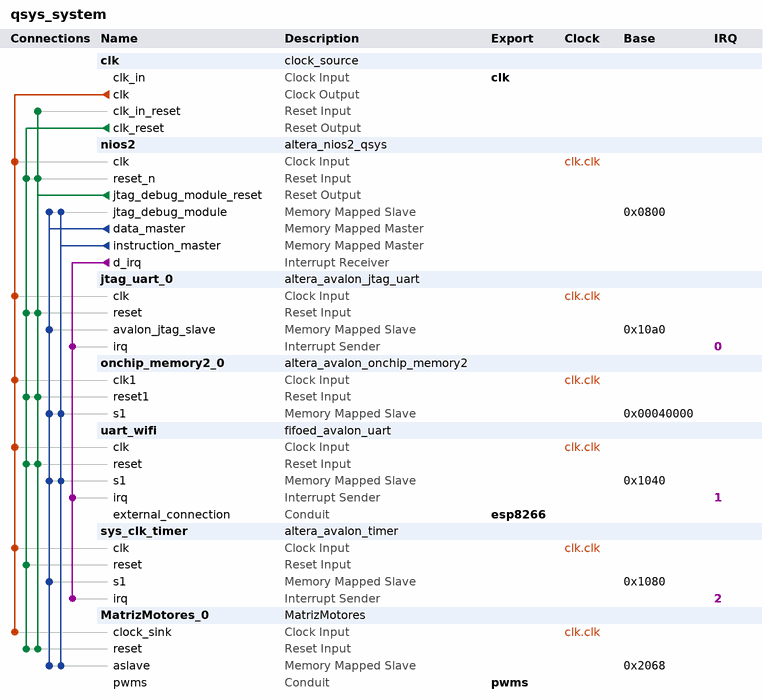
[diagram p0: system contents]
# Platform Designer (Qsys) system qsys_system, Cyclone IV GX EP4CGX150DF31C7
# Parameters at their usual value, and those the tool derives, are not listed.
package require -exact qsys 13.0.1.99.2
create_system qsys_system
set_project_property DEVICE_FAMILY {Cyclone IV GX}
set_project_property DEVICE EP4CGX150DF31C7

add_instance clk clock_source 13.0
set_instance_parameter_value clk clockFrequency 50000000

add_instance nios2 altera_nios2_qsys 13.0
set_instance_parameter_value nios2 resetSlave onchip_memory2_0.s1
set_instance_parameter_value nios2 mmu_TLBMissExcSlave None
set_instance_parameter_value nios2 exceptionSlave onchip_memory2_0.s1
set_instance_parameter_value nios2 breakSlave nios2.jtag_debug_module
set_instance_parameter_value nios2 impl Tiny
set_instance_parameter_value nios2 icache_size 4096

add_instance jtag_uart_0 altera_avalon_jtag_uart 13.0.1.99.2
set_instance_parameter_value jtag_uart_0 simInteractiveOptions NO_INTERACTIVE_WINDOWS

add_instance onchip_memory2_0 altera_avalon_onchip_memory2 13.0.1.99.2
set_instance_parameter_value onchip_memory2_0 dataWidth 32
set_instance_parameter_value onchip_memory2_0 dualPort false
set_instance_parameter_value onchip_memory2_0 initMemContent true
set_instance_parameter_value onchip_memory2_0 initializationFileName onchip_mem.hex
set_instance_parameter_value onchip_memory2_0 memorySize 100000

add_instance uart_wifi fifoed_avalon_uart 13.2
set_instance_parameter_value uart_wifi baud 115200
set_instance_parameter_value uart_wifi dataBits 8
set_instance_parameter_value uart_wifi fixedBaud true
set_instance_parameter_value uart_wifi parity NONE
set_instance_parameter_value uart_wifi simInteractiveInputEnable false
set_instance_parameter_value uart_wifi simInteractiveOutputEnable false
set_instance_parameter_value uart_wifi simTrueBaud false
set_instance_parameter_value uart_wifi stopBits 1
set_instance_parameter_value uart_wifi syncRegDepth 2
set_instance_parameter_value uart_wifi useCtsRts false
set_instance_parameter_value uart_wifi useEopRegister false
set_instance_parameter_value uart_wifi useRelativePathForSimFile false
set_instance_parameter_value uart_wifi use_status_bit_clear false
set_instance_parameter_value uart_wifi use_tx_fifo true
set_instance_parameter_value uart_wifi fifo_size_tx 1024
set_instance_parameter_value uart_wifi tx_fifo_LE false
set_instance_parameter_value uart_wifi tx_IRQ_Threshold 1
set_instance_parameter_value uart_wifi use_rx_fifo true
set_instance_parameter_value uart_wifi fifo_size_rx 1024
set_instance_parameter_value uart_wifi rx_fifo_LE false
set_instance_parameter_value uart_wifi rx_IRQ_Threshold 1
set_instance_parameter_value uart_wifi fifo_export_used false
set_instance_parameter_value uart_wifi hw_cts false
set_instance_parameter_value uart_wifi trans_pin false
set_instance_parameter_value uart_wifi use_timout false
set_instance_parameter_value uart_wifi timeout_value 4
set_instance_parameter_value uart_wifi use_gap_detection false
set_instance_parameter_value uart_wifi gap_value 4
set_instance_parameter_value uart_wifi use_timestamp false
set_instance_parameter_value uart_wifi use_ext_timestamp false
set_instance_parameter_value uart_wifi timestamp_width 8
set_instance_parameter_value uart_wifi export_handshake false
set_instance_parameter_value uart_wifi add_error_bits false
set_instance_parameter_value uart_wifi driver_pass_error_bits false

add_instance sys_clk_timer altera_avalon_timer 13.0.1.99.2
set_instance_parameter_value sys_clk_timer period 1
set_instance_parameter_value sys_clk_timer periodUnits MSEC

add_instance MatrizMotores_0 MatrizMotores 1.0
set_instance_parameter_value MatrizMotores_0 rows 4
set_instance_parameter_value MatrizMotores_0 cols 8
set_instance_parameter_value MatrizMotores_0 time_constant 1000000
set_instance_parameter_value MatrizMotores_0 divisor 2000

# connections
add_connection clk.clk jtag_uart_0.clk clock
add_connection clk.clk MatrizMotores_0.clock_sink clock
add_connection clk.clk nios2.clk clock
add_connection clk.clk onchip_memory2_0.clk1 clock
add_connection clk.clk sys_clk_timer.clk clock
add_connection clk.clk uart_wifi.clk clock
add_connection clk.clk_reset jtag_uart_0.reset reset
add_connection clk.clk_reset MatrizMotores_0.reset reset
add_connection clk.clk_reset nios2.reset_n reset
add_connection clk.clk_reset onchip_memory2_0.reset1 reset
add_connection clk.clk_reset sys_clk_timer.reset reset
add_connection clk.clk_reset uart_wifi.reset reset
add_connection nios2.jtag_debug_module_reset clk.clk_in_reset reset
add_connection nios2.jtag_debug_module_reset jtag_uart_0.reset reset
add_connection nios2.jtag_debug_module_reset MatrizMotores_0.reset reset
add_connection nios2.jtag_debug_module_reset nios2.reset_n reset
add_connection nios2.jtag_debug_module_reset onchip_memory2_0.reset1 reset
add_connection nios2.jtag_debug_module_reset uart_wifi.reset reset
add_connection nios2.data_master jtag_uart_0.avalon_jtag_slave avalon
set_connection_parameter_value nios2.data_master/jtag_uart_0.avalon_jtag_slave baseAddress 0x10a0
add_connection nios2.data_master MatrizMotores_0.aslave avalon
set_connection_parameter_value nios2.data_master/MatrizMotores_0.aslave baseAddress 0x2068
add_connection nios2.data_master nios2.jtag_debug_module avalon
set_connection_parameter_value nios2.data_master/nios2.jtag_debug_module baseAddress 0x0800
add_connection nios2.data_master onchip_memory2_0.s1 avalon
set_connection_parameter_value nios2.data_master/onchip_memory2_0.s1 baseAddress 0x00040000
add_connection nios2.data_master sys_clk_timer.s1 avalon
set_connection_parameter_value nios2.data_master/sys_clk_timer.s1 baseAddress 0x1080
add_connection nios2.data_master uart_wifi.s1 avalon
set_connection_parameter_value nios2.data_master/uart_wifi.s1 baseAddress 0x1040
add_connection nios2.instruction_master MatrizMotores_0.aslave avalon
set_connection_parameter_value nios2.instruction_master/MatrizMotores_0.aslave baseAddress 0x2068
add_connection nios2.instruction_master nios2.jtag_debug_module avalon
set_connection_parameter_value nios2.instruction_master/nios2.jtag_debug_module baseAddress 0x0800
add_connection nios2.instruction_master onchip_memory2_0.s1 avalon
set_connection_parameter_value nios2.instruction_master/onchip_memory2_0.s1 baseAddress 0x00040000
add_connection nios2.instruction_master uart_wifi.s1 avalon
set_connection_parameter_value nios2.instruction_master/uart_wifi.s1 baseAddress 0x1040
add_connection nios2.d_irq jtag_uart_0.irq interrupt
set_connection_parameter_value nios2.d_irq/jtag_uart_0.irq irqNumber 0
add_connection nios2.d_irq sys_clk_timer.irq interrupt
set_connection_parameter_value nios2.d_irq/sys_clk_timer.irq irqNumber 2
add_connection nios2.d_irq uart_wifi.irq interrupt
set_connection_parameter_value nios2.d_irq/uart_wifi.irq irqNumber 1

# exported interfaces
add_interface clk clock sink
set_interface_property clk EXPORT_OF clk.clk_in
add_interface esp8266 conduit end
set_interface_property esp8266 EXPORT_OF uart_wifi.external_connection
add_interface pwms conduit end
set_interface_property pwms EXPORT_OF MatrizMotores_0.pwms

set_interconnect_requirement {$system} qsys_mm.clockCrossingAdapter HANDSHAKE
set_interconnect_requirement {$system} qsys_mm.maxAdditionalLatency 1

save_system qsys_system.qsys
